# EAGLE design Signal Detector (EAGLE 6.4)
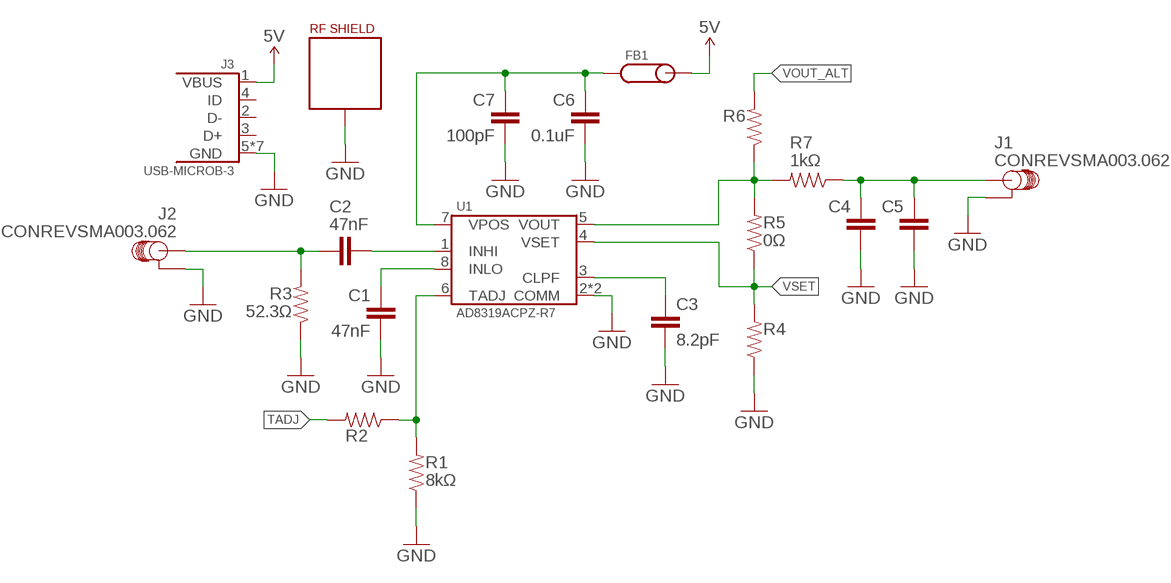
[diagram p0: schematic, sheet 1]

## Parts
C1  47nF  CAP-0603  [0603-CAP]
C2  47nF  CAP-0603  [0603-CAP]
C3  8.2pF  CAP-0603  [0603-CAP]
C4  CAP-0603  [0603-CAP]
C5  CAP-0603  [0603-CAP]
C6  0.1uF  CAP-0603  [0603-CAP]
C7  100pF  CAP-0603  [0603-CAP]
FB1  FERRITE-0603  [0603-FERRITE]
J1  CONREVSMA003.062  SMA-EDGE  [SMA-EDGE]
J2  CONREVSMA003.062  SMA-EDGE  [SMA-EDGE]
J3  USB-MICROB-3  [10118192-0001LF]
R1  8kΩ  RESISTOR-0603  [0603-CAP]
R2  RESISTOR-0603  [0603-CAP]
R3  52.3Ω  RESISTOR-0603  [0603-CAP]
R4  RESISTOR-0603  [0603-CAP]
R5  0Ω  RESISTOR-0603  [0603-CAP]
R6  RESISTOR-0603  [0603-CAP]
R7  1kΩ  RESISTOR-0603  [0603-CAP]
U1  AD8319ACPZ-R7  [VFDFN-8-3X2]
U$1  RF-SHIELD  [RF_SHIELD-.65X.65]

## Nets
5V: FB1.P$2 J3.1(VBUS)
GND: C1.2 C3.2 C4.2 C5.2 C6.2 C7.2 J1.P$1(GND) J1.P$2(GND) J1.P$3(GND) J1.P$4(GND) J2.P$1(GND) J2.P$2(GND) J2.P$3(GND) J2.P$4(GND) J3.5(GND) J3.P$6(GND) J3.P$7(GND) J3.P$8(GND) J3.P$9(GND) J3.P$10(GND) J3.P$11(GND) R1.1 R3.1 R4.1 U1.2(COMM) U1.PAD(COMM) U$1.P$1 U$1.P$2 U$1.P$3 U$1.P$4 U$1.P$5 U$1.P$6 U$1.P$7 U$1.P$8 U$1.P$9 U$1.P$10 U$1.P$11 U$1.P$12
N$1: R1.2 R2.1 U1.6(TADJ)
N$2: C1.1 U1.8(INLO)
N$3: C2.2 J2.SIGNAL R3.2
N$4: C2.1 U1.1(INHI)
N$5: C3.1 U1.3(CLPF)
N$7: R5.2 R6.1 R7.2 U1.5(VOUT)
N$8: C4.1 C5.1 J1.SIGNAL R7.1
N$9: C6.1 C7.1 FB1.P$1 U1.7(VPOS)
TADJ: R2.2
VOUT_ALT: R6.2
VSET: R4.2 R5.1 U1.4(VSET)
Unconnected: J3.2(D-) J3.3(D+) J3.4(ID)

## Library data of the parts
C1-C7 = Passives:CAP
FB1 = Passives:FERRITE
J1 J2 = Connectors:SMA
J3 = Connectors:USB-MICROB
R1-R7 = Passives:RESISTOR
U1 = AnalogDevices:AD8319
U$1 = Passives:RF-SHIELD

## Board
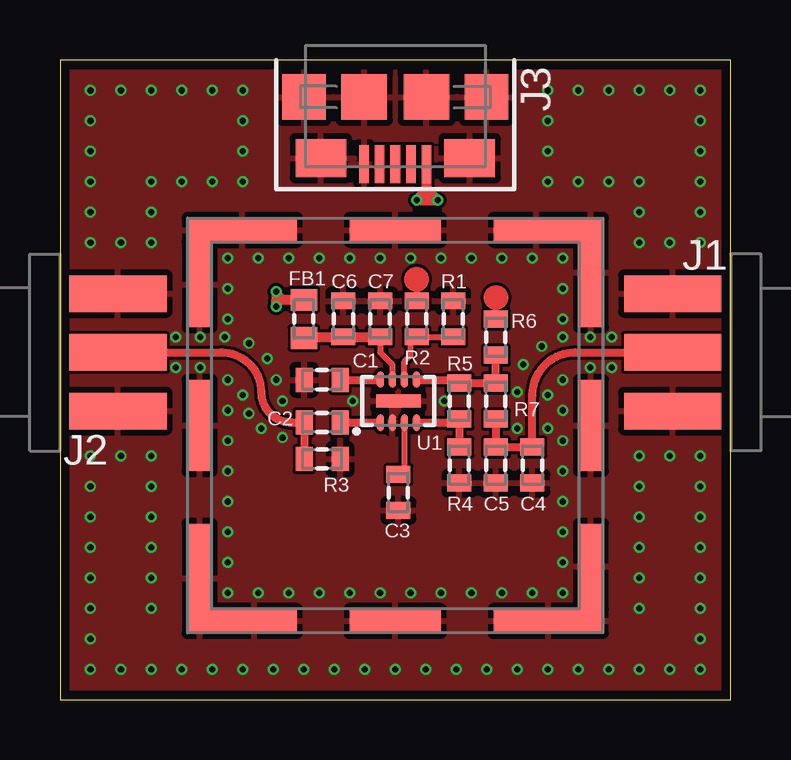
[diagram p1: board, top side]
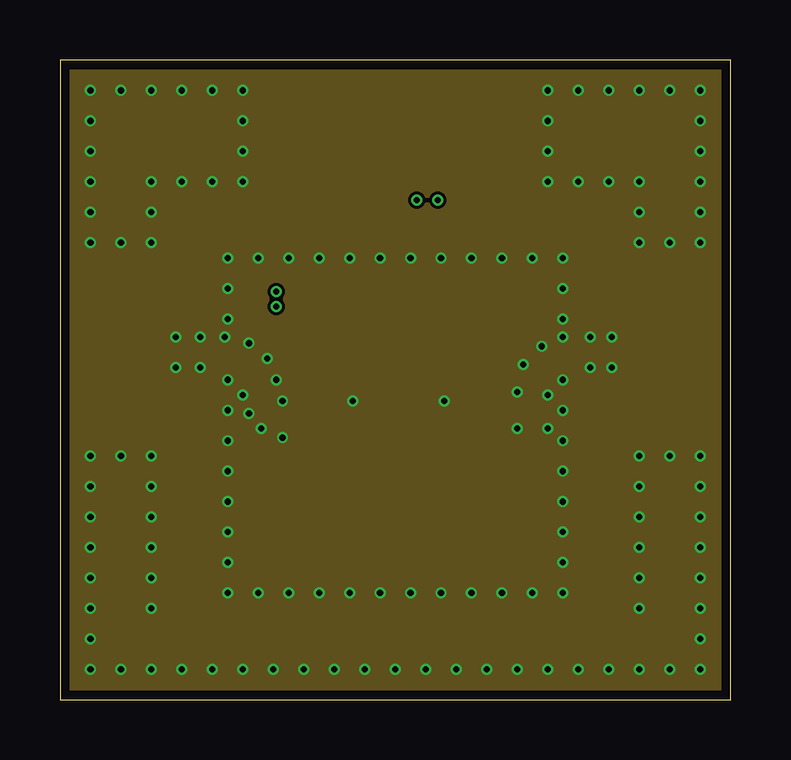
[diagram p2: board, inner layer Route2]
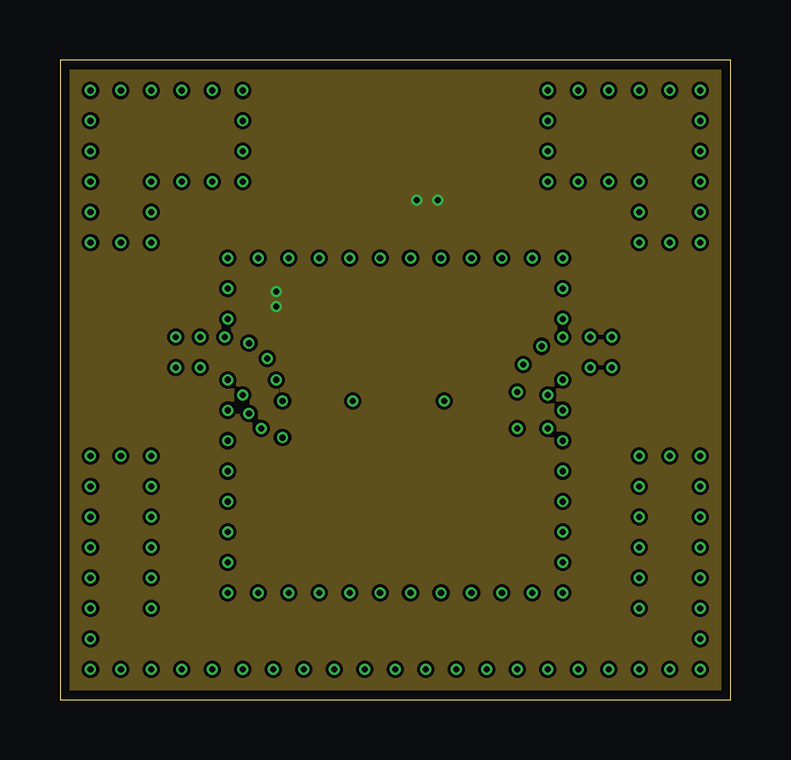
[diagram p3: board, inner layer Route15]
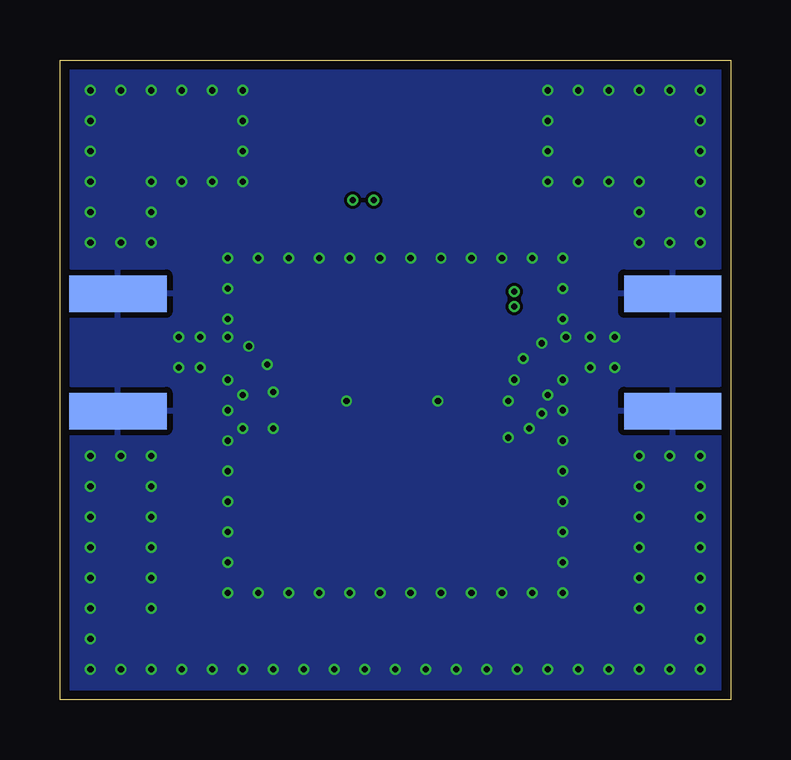
[diagram p4: board, bottom side, seen from below]

Size 27.94 x 26.67 mm. Coordinates in mm from the lower left corner, seen from the top.
Outline: 27.94,26.67 0,26.67 0,0 27.94,0 27.94,26.67
Copper layers (1*2*15*16): Top 0.035559375mm / dielectric 0.17018125mm / Route2 0.01778125mm / dielectric 47mil / Route15 0.01778125mm / dielectric 0.17018125mm / Bottom 0.035559375mm
Design rules "OSHPark-4layer *": minimum track width 5mil, minimum drill 10mil, track to track 5mil, track to pad 5mil, pad to pad 5mil, via to via 5mil, smd to smd 5mil, copper to edge 15mil, drill to drill 6mil, minimum pad ring 4mil, minimum via ring 4mil, stop-mask expansion 4mil, vias tented up to drill 20mil, thermal gap 10mil

### Footprints (pad centres in the part's own frame; a part is rotated, then mirrored left to right if it is on the bottom)
0603-CAP = smd 0.7 x 1: 1 -0.75,0; 2 0.75,0
0603-FERRITE = smd 0.9 x 1.1: P$1 -0.8,0; P$2 0.8,0
SMA-EDGE = smd 4.06 x 1.52: P$1 -2.41,2.45; P$2 -2.41,-2.45; SIGNAL -2.41,0 | smd 4.06 x 1.52 bottom: P$3 -2.41,-2.45; P$4 -2.41,2.45
10118192-0001LF = smd 1.6 x 0.4: 1 -0.1,1.3; 2 -0.1,0.65; 3 -0.1,0; 4 -0.1,-0.65; 5 -0.1,-1.3 | smd 1.6 x 2.1: P$6 -0.35,-3.1; P$7 -0.35,3.1 | smd 1.9 x 1.9: P$8 -2.9,1.3; P$9 -2.9,-1.3 | smd 1.9 x 1.8: P$10 -2.9,3.8; P$11 -2.9,-3.8
VFDFN-8-3X2 = smd 0.7 x 0.3: 1 -0.9,0.75; 2 -0.9,0.25; 3 -0.9,-0.25; 4 -0.9,-0.75; 5 0.9,-0.75; 6 0.9,-0.25; 7 0.9,0.25; 8 0.9,0.75 | smd 0.55 x 1.85: PAD 0,0
RF_SHIELD-.65X.65 = smd 1 x 4.55: P$1 -8.15,-6.375; P$3 8.15,6.375 | smd 4.55 x 1: P$2 -6.375,8.15; P$4 6.375,-8.15 | smd 1 x 3.8: P$5 -8.15,0; P$6 8.15,0 | smd 3.8 x 1: P$7 0,8.15; P$8 0,-8.15 | smd 1 x 3.55: P$9 -8.15,5.875; P$11 8.15,-5.875 | smd 3.55 x 1: P$10 -5.875,-8.15; P$12 5.875,8.15

### Placement (x,y rotation side)
C1  10.92,13.34 180 top
C2  10.92,11.56 180 top
C3  14.1,8.64 270 top
C4  19.68,9.78 270 top
C5  18.16,9.78 270 top
C6  11.81,15.88 90 top
C7  13.34,15.88 90 top
FB1  10.16,15.88 90 top
J1  27.94,14.48 0 top
J2  0,14.48 180 top
J3  13.97,22.23 270 top
R1  16.38,15.88 270 top
R2  14.86,15.88 90 top
R3  10.92,10.03 180 top
R4  16.64,9.78 90 top
R5  16.64,12.45 90 top
R6  18.16,15.11 90 top
R7  18.16,12.45 90 top
U1  14.1,12.45 90 top
U$1  13.97,11.43 0 top

### Tracks (layer width: path | path; a pad name or v marks a point on that pad's centre or on a via)
5V  (via drill 0.25)
  Top 0.254: v9.02,17.02 9.27,16.76 | v9.02,16.38 9.27,16.64
  Top 0.406: 15.27,21.24 v14.86,20.83 v15.75,20.83 15.27,21.31 J3.1 | v9.02,17.02 v9.02,16.38 9.02,16.68 FB1.P$2
  pour Route15 (rank 2): -1.91,28.57 29.84,28.57 29.84,-1.91 -1.91,-1.91
GND  (via drill 0.25)
  other vias: 1.27,19.05 2.54,19.05 3.81,19.05 7.62,24.13 7.62,22.86 7.62,21.59 20.32,21.59 20.32,22.86 20.32,24.13 20.32,25.4 21.59,25.4 22.86,25.4 24.13,25.4 25.4,25.4 26.67,25.4 26.67,24.13 26.67,22.86 26.67,21.59 26.67,20.32 26.67,19.05 25.4,19.05 24.13,19.05 3.81,10.16 2.54,10.16 1.27,10.16 1.27,8.89 1.27,7.62 1.27,6.35 1.27,5.08 1.27,3.81 1.27,2.54 1.27,1.27 2.54,1.27 3.81,1.27 5.08,1.27 6.35,1.27 7.62,1.27 8.89,1.27 10.16,1.27 11.43,1.27 12.7,1.27 13.97,1.27 15.24,1.27 16.51,1.27 17.78,1.27 19.05,1.27 20.32,1.27 21.59,1.27 22.86,1.27 24.13,1.27 25.4,1.27 26.67,1.27 26.67,2.54 26.67,3.81 26.67,5.08 26.67,6.35 26.67,7.62 26.67,8.89 26.67,10.16 25.4,10.16 24.13,10.16 6.99,18.41 8.26,18.41 9.53,18.41 10.79,18.41 12.06,18.41 13.34,18.41 14.61,18.41 15.88,18.41 17.14,18.41 18.41,18.41 19.68,18.41 20.95,18.41 20.95,17.14 20.95,15.88 20.95,4.45 20.95,5.71 20.95,6.99 20.95,8.26 20.95,9.53 20.95,10.79 20.95,12.06 20.95,13.34 19.68,4.45 18.41,4.45 17.14,4.45 15.88,4.45 14.61,4.45 13.34,4.45 12.06,4.45 10.79,4.45 9.53,4.45 8.26,4.45 6.99,4.45 6.99,5.71 6.99,6.99 6.99,8.26 6.99,9.53 6.99,17.14 6.99,15.88 6.99,10.79 6.99,12.06 6.99,13.34 24.13,20.32 24.13,21.59 22.86,21.59 21.59,21.59 3.81,20.32 3.81,21.59 5.08,21.59 6.35,21.59 3.81,8.89 3.81,7.62 3.81,6.35 3.81,5.08 3.81,3.81 24.13,3.81 24.13,5.08 24.13,6.35 24.13,7.62 24.13,8.89 1.27,20.32 1.27,21.59 1.27,22.86 1.27,24.13 1.27,25.4 2.54,25.4 3.81,25.4 5.08,25.4 6.35,25.4 7.62,25.4 7.62,12.7 8.38,11.3 9.27,10.92 9.27,12.45 9.02,13.34 7.87,14.86 6.86,15.11 5.84,15.11 5.84,13.84 4.83,13.84 4.83,15.11 8.64,14.22 7.87,11.94 22.99,15.11 22.1,15.11 22.1,13.84 22.99,13.84 20.95,15.11 20.07,14.73 19.3,13.97 19.05,12.83 19.05,11.3 20.32,11.3 20.32,12.7 12.19,12.45 16,12.45
  pour Top (rank 2): -0.64,27.3 28.57,27.3 28.57,-0.64 -0.64,-0.64
  pour Route2 (rank 2): -1.27,27.94 29.21,27.94 29.21,-1.27 -1.27,-1.27
  pour Bottom (rank 2): -2.54,29.21 30.48,29.21 30.48,-2.54 -2.54,-2.54
N$1
  Top 0.254: U1.6 14.35,14.09 14.61,14.35 14.61,14.87 R2.1 R1.2
N$2
  Top 0.254: 13.21,13.34 U1.8
  Top 0.335: C1.1 13.21,13.34
N$3
  Top 0.335: J2.SIGNAL 6.73,14.48 arc-90 8.38,12.83 arc90 9.65,11.56 C2.2 R3.2
N$4
  Top 0.254: 13.21,11.56 U1.1
  Top 0.335: C2.1 13.21,11.56
N$5
  Top 0.254: U1.3 14.35,9.64 C3.1
N$6
  Top 0.254: 14.86,17.4 14.86,16.64
N$7
  Top 0.254: U1.5 14.99,13.34 | 16.49,13.35 R5.2
  Top 0.335: 14.99,13.34 16.51,13.34 16.49,13.35 | R5.2 R7.2 R6.1
N$8
  Top 0.335: R7.1 C5.1 C4.1 19.68,12.7 arc-90 21.46,14.48 J1.SIGNAL
N$9
  Top 0.254: C7.1 13.34,14.48 13.85,13.97 U1.7
  Top 0.406: FB1.P$1 10.16,15.12 C6.1 C7.1
N$10
  Top 0.254: 18.16,15.88 18.16,16.64
VSET
  Top 0.254: U1.4 14.97,11.55 | 16.49,11.55 R5.1
  Top 0.335: 14.97,11.55 14.99,11.56 16.51,11.56 16.49,11.55 | R5.1 R4.2
(copper drawn outside any net)
  shapes: Top circle x2